# EAGLE design ATOM - 3x Attenuverter Rev6 (EAGLE 9.6.2)
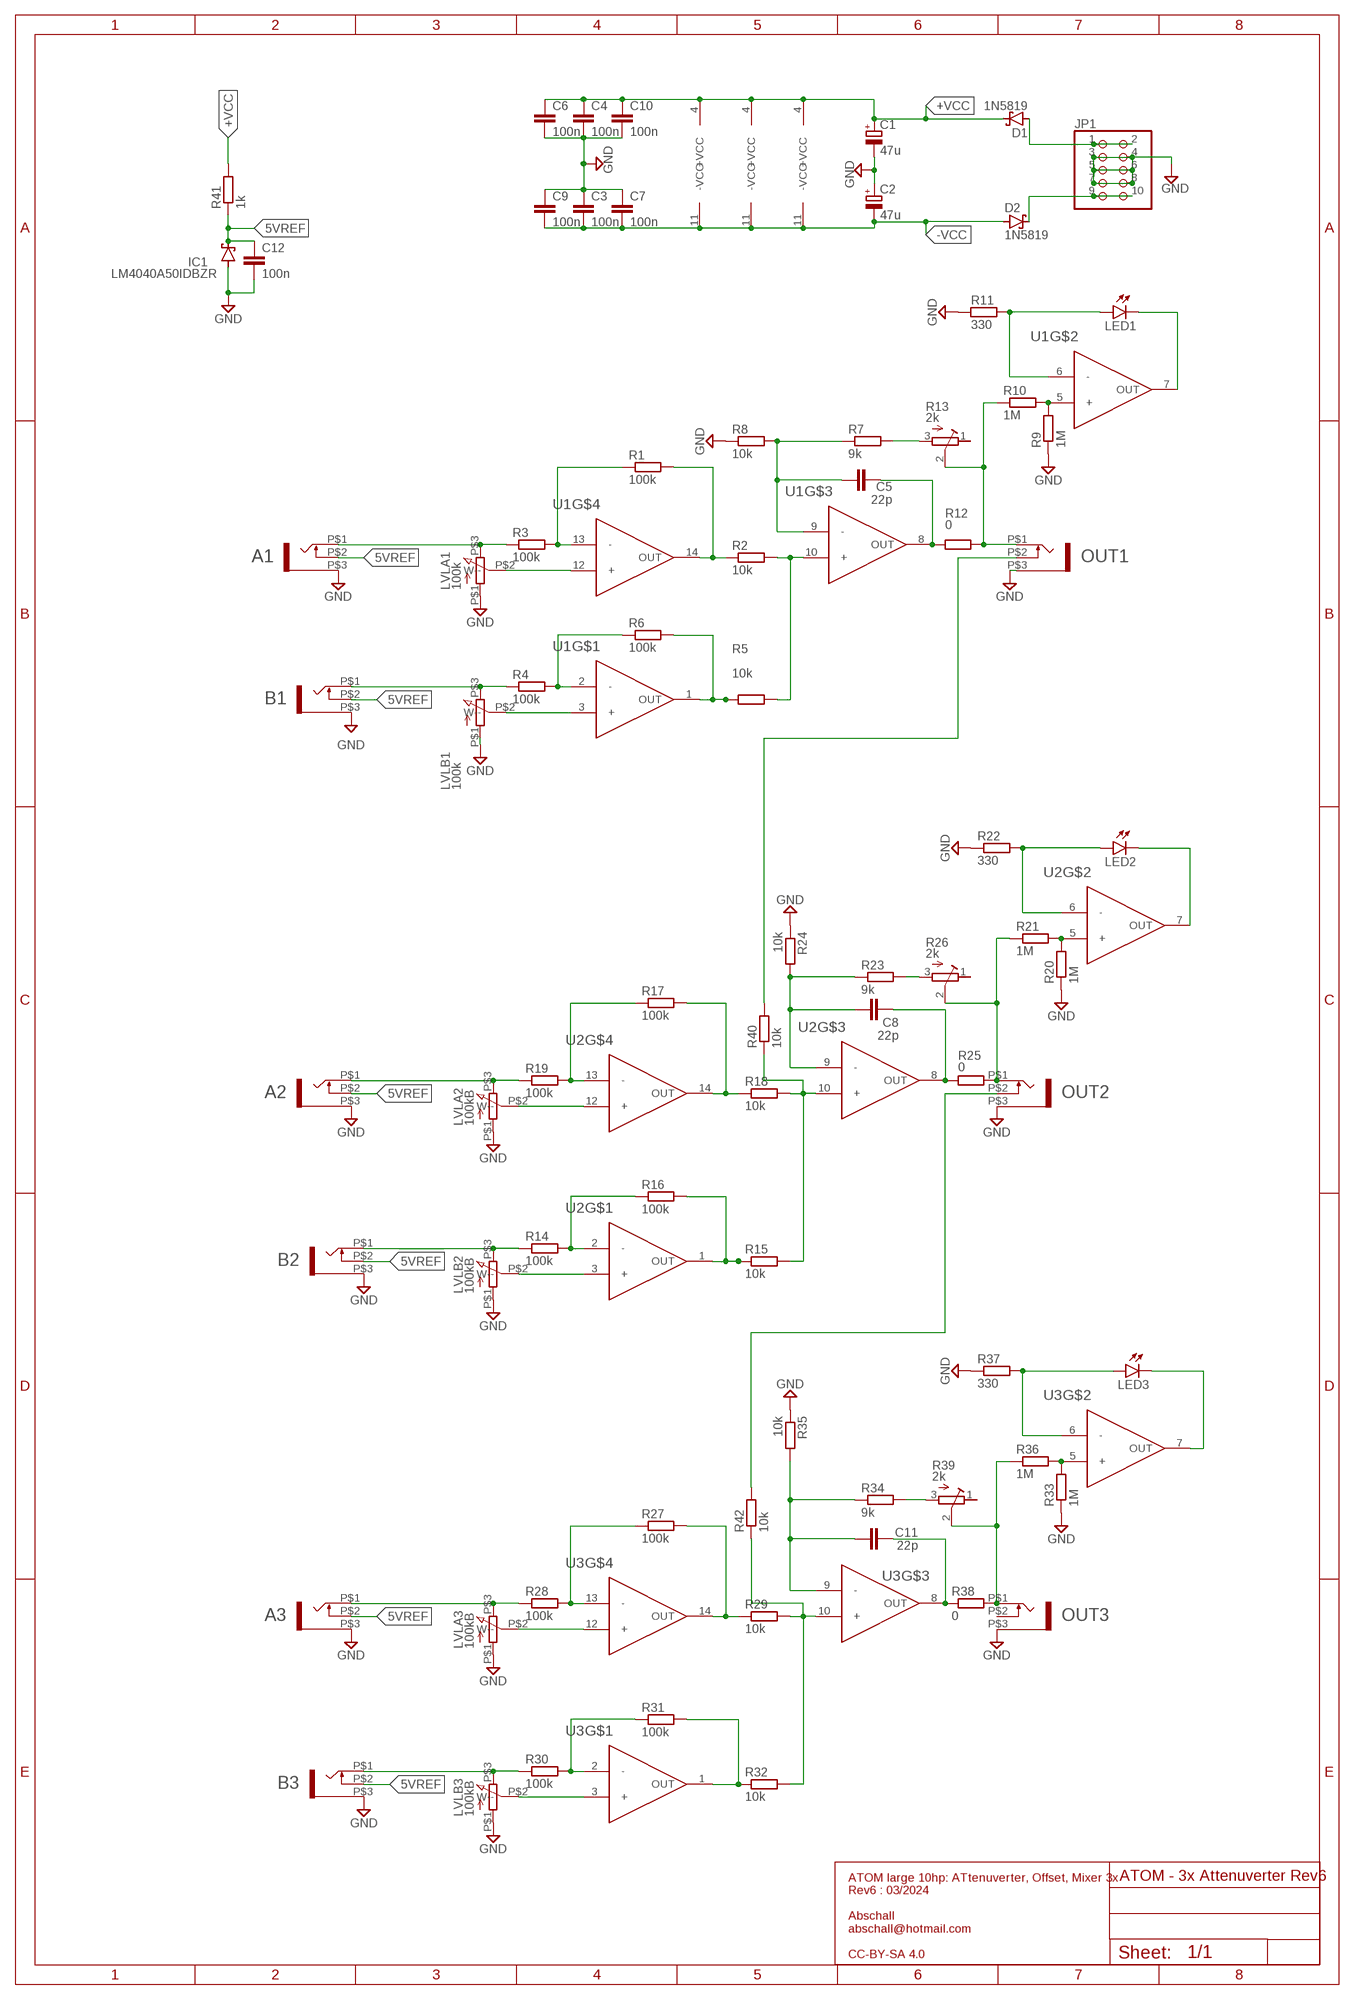
[diagram p0: schematic, sheet 1]

## Parts
A1  WQP-PJ301M-12_JACK  [WQP-PJ301M-12_JACK]
A2  WQP-PJ301M-12_JACK  [WQP-PJ301M-12_JACK]
A3  WQP-PJ301M-12_JACK  [WQP-PJ301M-12_JACK]
B1  WQP-PJ301M-12_JACK  [WQP-PJ301M-12_JACK]
B2  WQP-PJ301M-12_JACK  [WQP-PJ301M-12_JACK]
B3  WQP-PJ301M-12_JACK  [WQP-PJ301M-12_JACK]
C1  47u  CPOL-EUB  [PANASONIC_B]
C2  47u  CPOL-EUB  [PANASONIC_B]
C3  100n  C-EUC0805  [C0805]
C4  100n  C-EUC0805  [C0805]
C5  22p  C-EUC0805  [C0805]
C6  100n  C-EUC0805  [C0805]
C7  100n  C-EUC0805  [C0805]
C8  22p  C-EUC0805  [C0805]
C9  100n  C-EUC0805  [C0805]
C10  100n  C-EUC0805  [C0805]
C11  22p  C-EUC0805  [C0805]
C12  100n  C-EUC0805  [C0805]
D1  1N5819  [SOD123]
D2  1N5819  [SOD123]
IC1  LM4040A50IDBZR  LM4040  [SOT23]
JP1  PINHD-2X5  [2X05]
LED1  LED3MM  [LED3MM]
LED2  LED3MM  [LED3MM]
LED3  LED3MM  [LED3MM]
LVLA1  100k  ALPHA9MM  [ALPHA9MM]
LVLA2  100kB  ALPHA9MM  [ALPHA9MM]
LVLA3  100kB  ALPHA9MM  [ALPHA9MM]
LVLB1  100k  ALPHA9MM  [ALPHA9MM]
LVLB2  100kB  ALPHA9MM  [ALPHA9MM]
LVLB3  100kB  ALPHA9MM  [ALPHA9MM]
OUT1  WQP-PJ301M-12_JACK  [WQP-PJ301M-12_JACK]
OUT2  WQP-PJ301M-12_JACK  [WQP-PJ301M-12_JACK]
OUT3  WQP-PJ301M-12_JACK  [WQP-PJ301M-12_JACK]
R1  100k  R-EU_R0805  [R0805]
R2  10k  R-EU_R0805  [R0805]
R3  100k  R-EU_R0805  [R0805]
R4  100k  R-EU_R0805  [R0805]
R5  10k  R-EU_R0805  [R0805]
R6  100k  R-EU_R0805  [R0805]
R7  9k  R-EU_R0805  [R0805]
R8  10k  R-EU_R0805  [R0805]
R9  1M  R-EU_R0805  [R0805]
R10  1M  R-EU_R0805  [R0805]
R11  330  R-EU_R0805  [R0805]
R12  0  R-EU_R0805  [R0805]
R13  2k  R-TRIMM3314J  [RTRIM3314J]
R14  100k  R-EU_R0805  [R0805]
R15  10k  R-EU_R0805  [R0805]
R16  100k  R-EU_R0805  [R0805]
R17  100k  R-EU_R0805  [R0805]
R18  10k  R-EU_R0805  [R0805]
R19  100k  R-EU_R0805  [R0805]
R20  1M  R-EU_R0805  [R0805]
R21  1M  R-EU_R0805  [R0805]
R22  330  R-EU_R0805  [R0805]
R23  9k  R-EU_R0805  [R0805]
R24  10k  R-EU_R0805  [R0805]
R25  0  R-EU_R0805  [R0805]
R26  2k  R-TRIMM3314J  [RTRIM3314J]
R27  100k  R-EU_R0805  [R0805]
R28  100k  R-EU_R0805  [R0805]
R29  10k  R-EU_R0805  [R0805]
R30  100k  R-EU_R0805  [R0805]
R31  100k  R-EU_R0805  [R0805]
R32  10k  R-EU_R0805  [R0805]
R33  1M  R-EU_R0805  [R0805]
R34  9k  R-EU_R0805  [R0805]
R35  10k  R-EU_R0805  [R0805]
R36  1M  R-EU_R0805  [R0805]
R37  330  R-EU_R0805  [R0805]
R38  0  R-EU_R0805  [R0805]
R39  2k  R-TRIMM3314J  [RTRIM3314J]
R40  10k  R-EU_R0805  [R0805]
R41  1k  R-EU_R0805  [R0805]
R42  10k  R-EU_R0805  [R0805]
U1  TL74H  [SO14]
U2  TL74H  [SO14]
U3  TL74H  [SO14]

## Nets
5VREF: A1.P$2 A2.P$2 A3.P$2 B1.P$2 B2.P$2 B3.P$2 C12.1 IC1.1(C) R41.1
+VCC: C1.+ C4.1 C6.1 C10.1 D1.C R41.2 U1.4(+VCC) U2.4(+VCC) U3.4(+VCC)
-VCC: C2.- C3.2 C7.2 C9.2 D2.A U1.11(-VCC) U2.11(-VCC) U3.11(-VCC)
GND: A1.P$3 A2.P$3 A3.P$3 B1.P$3 B2.P$3 B3.P$3 C1.- C2.+ C3.1 C4.2 C6.2 C7.1 C9.1 C10.2 C12.2 IC1.2(A) JP1.3 JP1.4 JP1.5 JP1.6 JP1.7 JP1.8 LVLA1.P$1 LVLA2.P$1 LVLA3.P$1 LVLB1.P$1 LVLB2.P$1 LVLB3.P$1 OUT1.P$3 OUT2.P$3 OUT3.P$3 R8.1 R9.1 R11.1 R20.1 R22.1 R24.1 R33.1 R35.1 R37.1
N$1: A1.P$1 LVLA1.P$3 R3.1
N$2: R1.1 R3.2 U1.13(-)
N$3: LVLB1.P$2(W--) U1.3(+)
N$4: R1.2 R2.1 U1.14(OUT)
N$5: R2.2 R5.2 U1.10(+)
N$6: R5.1 R6.2 U1.1(OUT)
N$7: R4.2 R6.1 U1.2(-)
N$8: B1.P$1 LVLB1.P$3 R4.1
N$10: C5.1 R7.1 R8.2 U1.9(-)
N$11: OUT1.P$1 R10.1 R12.2 R13.2(S)
N$12: LED1.A R11.2 U1.6(-)
N$13: LED1.K(C) U1.7(OUT)
N$14: R9.2 R10.2 U1.5(+)
N$15: A2.P$1 LVLA2.P$3 R19.1
N$16: LVLA1.P$2(W--) U1.12(+)
N$17: R17.1 R19.2 U2.13(-)
N$18: R17.2 R18.1 U2.14(OUT)
N$19: R15.2 R18.2 R40.1 U2.10(+)
N$20: R14.2 R16.1 U2.2(-)
N$21: C8.1 R23.1 R24.2 U2.9(-)
N$22: B2.P$1 LVLB2.P$3 R14.1
N$23: OUT2.P$1 R21.1 R25.2 R26.2(S)
N$24: LED2.A R22.2 U2.6(-)
N$25: LED2.K(C) U2.7(OUT)
N$26: R20.2 R21.2 U2.5(+)
N$27: R15.1 R16.2 U2.1(OUT)
N$28: LVLA2.P$2(W--) U2.12(+)
N$29: A3.P$1 LVLA3.P$3 R28.1
N$30: LVLB2.P$2(W--) U2.3(+)
N$31: R27.1 R28.2 U3.13(-)
N$32: R27.2 R29.1 U3.14(OUT)
N$33: R29.2 R32.2 R42.1 U3.10(+)
N$34: R30.2 R31.1 U3.2(-)
N$35: C11.1 R34.1 R35.2 U3.9(-)
N$36: B3.P$1 LVLB3.P$3 R30.1
N$37: R23.2 R26.3(A)
N$38: LED3.A R37.2 U3.6(-)
N$39: LED3.K(C) U3.7(OUT)
N$40: R33.2 R36.2 U3.5(+)
N$41: R31.2 R32.1 U3.1(OUT)
N$42: LVLA3.P$2(W--) U3.12(+)
N$43: D2.C JP1.9 JP1.10
N$44: D1.A JP1.1 JP1.2
N$45: LVLB3.P$2(W--) U3.3(+)
N$46: C5.2 R12.1 U1.8(OUT)
N$47: C8.2 R25.1 U2.8(OUT)
N$48: C11.2 R38.1 U3.8(OUT)
N$49: OUT2.P$2 R42.2
N$50: OUT1.P$2 R40.2
N$51: OUT3.P$1 R36.1 R38.2 R39.2(S)
N$52: R7.2 R13.3(A)
N$53: R34.2 R39.3(A)
Unconnected: OUT3.P$2 R13.1(E) R26.1(E) R39.1(E)

## Notes on the sheet
- ATOM large 10hp: ATtenuverter, Offset, Mixer 3x
  Rev6 : 03/2024
  
  Abschall
  abschall@hotmail.com
  
  CC-BY-SA 4.0

## Library data of the parts
A1-A3 B1-B3 OUT1-OUT3 = thonkiconn:WQP-PJ301M-12_JACK
C1 C2 = rcl:CPOL-EU: POLARIZED CAPACITOR, European symbol; SPICEPREFIX: C
C3-C12 = resistor:C-EU: CAPACITOR, European symbol
D1 D2 = personal-ICs:1N5819
IC1 = personal-ICs:LM4040
JP1 = pinhead:PINHD-2X5: PIN HEADER
LED1-LED3 = led:LED: LED OSRAM: - CHIPLED LG R971, LG N971, LY N971, LG Q971, LY Q971, LO R971, LY R971 LH N974, LH R974 LS Q976, LO Q976, LY Q976 LO Q996 - Hyper CHIPLED LW Q18S LB Q993, LB Q99A, LB R99A - SideLED LS A670, LO A670, LY A670, LG A670, LP A670 LB A673, LV A673, LT A673, LW A673 LH A674 LY A675 LS A676, LA A676, LO A676, LY A676, LW A676 LS A679, LY A679, LG A679 - Hyper Micro SIDELED® LS Y876, LA Y876, LO Y876, LY Y876 LT Y87S - SmartLED LW L88C, LW L88S LB L89C, LB L89S, LG L890 LS L89K, LO L89K, LY L89K LS L896, LA L896, LO L896, LY L896 - TOPLED LS T670, LO T670, LY T670, LG T670, LP T670 LSG T670, LSP T670, LSY T670, LOP T670, LYG T670 LG T671, LOG T671, LSG T671 LB T673, LV T673, LT T673, LW T673 LH T674 LS T676, LA T676, LO T676, LY T676, LB T676, LH T676, LSB T676, LW T676 LB T67C, LV T67C, LT T67C, LS T67K, LO T67K, LY T67K, LW E67C LS E67B, LA E67B, LO E67B, LY E67B, LB E67C, LV E67C, LT E67C LW T67C LS T679, LY T679, LG T679 LS T770, LO T770, LY T770, LG T770, LP T770 LB T773, LV T773, LT T773, LW T773 LH T774 LS E675, LA E675, LY E675, LS T675 LS T776, LA T776, LO T776, LY T776, LB T776 LHGB T686 LT T68C, LB T68C - Hyper Mini TOPLED® LB M676 - Mini TOPLED Santana® LG M470 LS M47K, LO M47K, LY M47K Source: http://www.osram.convergy.de LUXEON: - LUMILED® LXK2-PW12-R00, LXK2-PW12-S00, LXK2-PW14-U00, LXK2-PW14-V00 LXK2-PM12-R00, LXK2-PM12-S00, LXK2-PM14-U00 LXK2-PE12-Q00, LXK2-PE12-R00, LXK2-PE12-S00, LXK2-PE14-T00, LXK2-PE14-U00 LXK2-PB12-K00, LXK2-PB12-L00, LXK2-PB12-M00, LXK2-PB14-N00, LXK2-PB14-P00, LXK2-PB14-Q00 LXK2-PR12-L00, LXK2-PR12-M00, LXK2-PR14-Q00, LXK2-PR14-R00 LXK2-PD12-Q00, LXK2-PD12-R00, LXK2-PD12-S00 LXK2-PH12-R00, LXK2-PH12-S00 LXK2-PL12-P00, LXK2-PL12-Q00, LXK2-PL12-R00 Source: www.luxeon.com KINGBRIGHT: KA-3528ASYC Source: www.kingbright.com
LVLA1-LVLA3 LVLB1-LVLB3 = potentiometer:ALPHA9MM
R1-R12 R14-R25 R27-R38 R40-R42 = resistor:R-EU_: RESISTOR, European symbol
R13 R26 R39 = resistor:R-TRIMM: Trimm resistor
U1-U3 = personal devices:TL74H

## Board
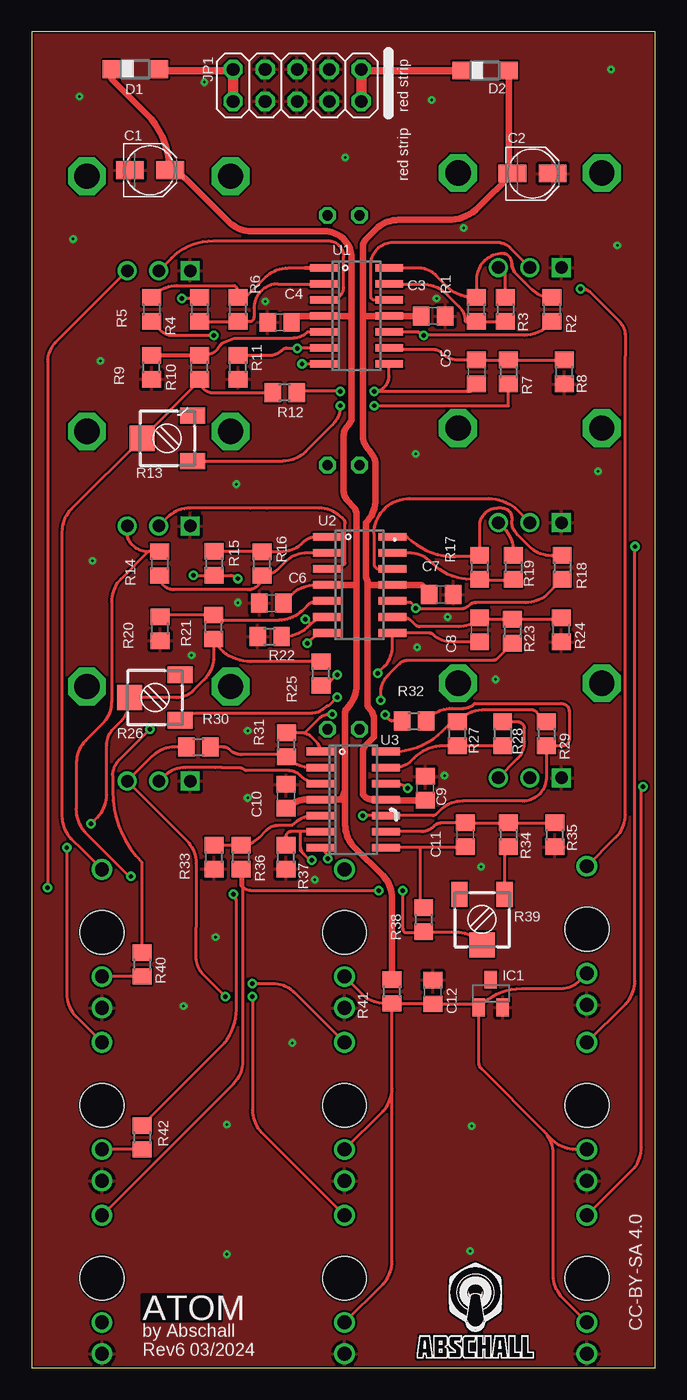
[diagram p1: board, top side]
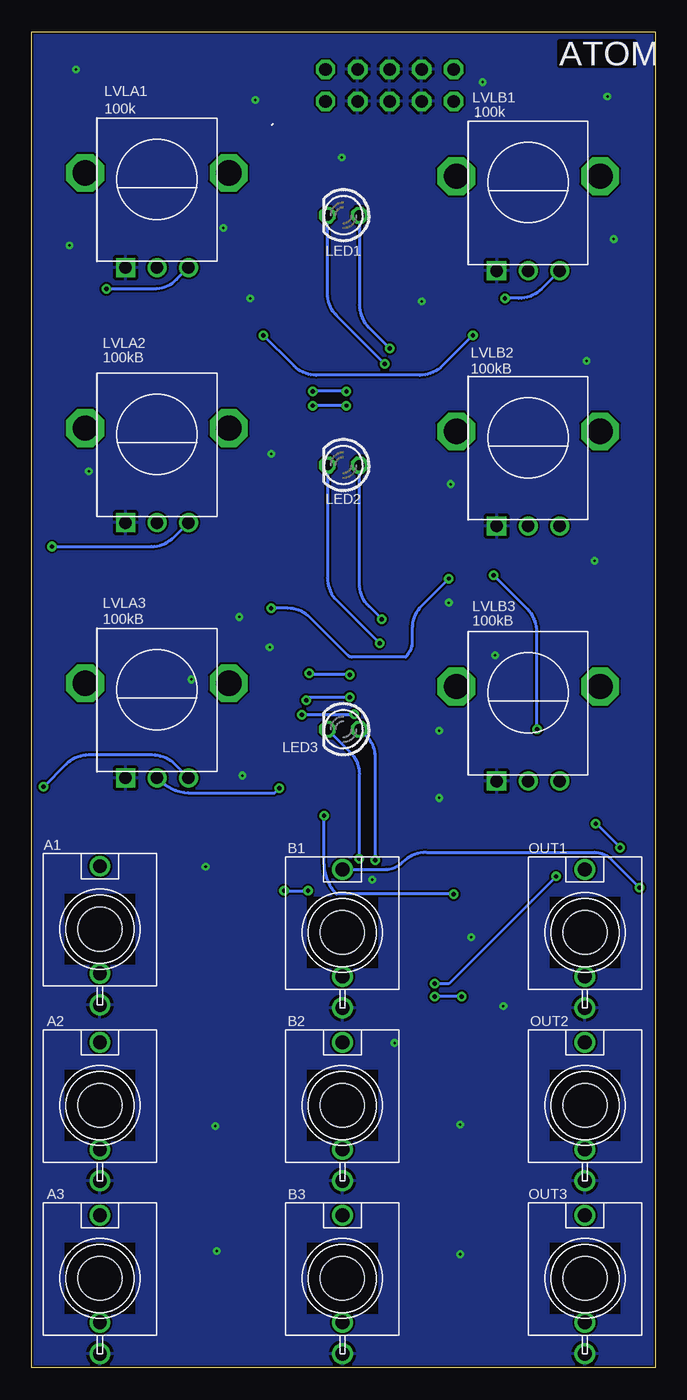
[diagram p2: board, bottom side, seen from below]

Size 49.5 x 106 mm. Coordinates in mm from the lower left corner, seen from the top.
Outline: 0,0 49.5,0 49.5,106 0,106 0,0
Copper layers (1*16): Top 0.035mm / dielectric 1.5mm / Bottom 0.035mm
Design rules "default *": minimum track width 6mil, minimum drill 0.35mm, track to track 6mil, track to pad 6mil, pad to pad 6mil, via to via 6mil, smd to smd 6mil, copper to edge 6mil, drill to drill 6mil, minimum pad ring 10mil, minimum via ring 8mil, stop-mask expansion 4mil, vias tented up to drill 0mil, thermal gap 10mil

### Footprints (pad centres in the part's own frame; a part is rotated, then mirrored left to right if it is on the bottom)
WQP-PJ301M-12_JACK = drill 1.1: P$1 0,5; P$2 0,-3.5; P$3 0,-5.992 | hole 3.5: 0,0
PANASONIC_B = smd 2.2 x 1.4: + 1.6,0; - -1.6,0
C0805 = smd 1.3 x 1.5: 1 -0.95,0; 2 0.95,0
SOD123 = smd 1.4 x 1.4: A 1.9,0; C -1.9,0
SOT23 = smd 1 x 1.4: 1 -0.95,-1.1; 2 0.95,-1.1; 3 0,1.1
2X05 = drill 1.016 octagon: 1 -5.08,-1.27; 2 -5.08,1.27; 3 -2.54,-1.27; 4 -2.54,1.27; 5 0,-1.27; 6 0,1.27; 7 2.54,-1.27; 8 2.54,1.27; 9 5.08,-1.27; 10 5.08,1.27
LED3MM = drill 0.813 octagon: A -1.27,0; K 1.27,0
ALPHA9MM = drill 2 octagon: GND -5.715,0.515; GND2 5.685,0.515 | drill 1 square: P$1 -2.515,-6.985 | drill 1: P$2 -0.015,-6.985; P$3 2.485,-6.985
R0805 = smd 1.3 x 1.5: 1 -0.95,0; 2 0.95,0
RTRIM3314J = smd 1.3 x 2: 1 1.8,-2; 3 -1.8,-2 | smd 2 x 2: 2 0,2
SO14 = smd 0.6 x 2.2: 1 -3.81,-2.6; 2 -2.54,-2.6; 3 -1.27,-2.6; 4 0,-2.6; 5 1.27,-2.6; 6 2.54,-2.6; 7 3.81,-2.6; 8 3.81,2.6; 9 2.54,2.6; 10 1.27,2.6; 11 0,2.6; 12 -1.27,2.6; 13 -2.54,2.6; 14 -3.81,2.6

### Placement (x,y rotation side)
A1  44.07,34.8 0 bottom
A2  44.07,20.83 0 bottom
A3  44.07,7.11 0 bottom
B1  24.83,34.54 0 bottom
B2  24.83,20.83 0 bottom
B3  24.83,7.11 0 bottom
C1  9.4,95 0 top
C2  39.75,94.74 0 top
C3  31.88,83.44 180 top
C4  19.68,82.93 180 top
C5  35.31,78.99 270 top
C6  19.03,60.66 180 top
C7  32.51,61.34 180 top
C8  35.56,58.55 270 top
C9  31.24,45.97 270 top
C10  20.19,45.34 90 top
C11  34.42,42.29 270 top
C12  31.84,29.83 90 top
D1  8.25,103.01 0 top
D2  35.98,102.91 0 top
IC1  36.44,29.7 0 top
JP1  21.08,101.73 0 top
LED1  24.75,91.42 180 bottom
LED2  24.75,71.61 180 bottom
LED3  24.75,50.66 180 bottom
LVLA1  39.53,94.27 0 bottom
LVLA2  39.53,74.03 0 bottom
LVLA3  39.53,53.79 0 bottom
LVLB1  10.08,94.01 0 bottom
LVLB2  10.08,73.77 0 bottom
LVLB3  10.08,53.54 0 bottom
OUT1  5.59,34.54 0 bottom
OUT2  5.59,20.83 0 bottom
OUT3  5.59,7.11 0 bottom
R1  35.31,83.95 90 top
R2  41.27,83.95 270 top
R3  37.59,83.95 270 top
R4  13.34,83.95 270 top
R5  9.53,83.95 270 top
R6  16.38,83.95 90 top
R7  37.85,78.99 270 top
R8  42.29,78.99 90 top
R9  9.53,79.38 90 top
R10  13.34,79.38 90 top
R11  16.38,79.38 90 top
R12  20.08,77.36 180 top
R13  10.78,73.73 90 top
R14  10.16,63.8 270 top
R15  14.48,63.81 270 top
R16  18.29,63.8 90 top
R17  35.56,63.5 90 top
R18  42.1,63.5 270 top
R19  38.23,63.5 270 top
R20  10.2,58.64 90 top
R21  14.45,58.77 90 top
R22  18.89,58 0 top
R23  38.16,58.42 270 top
R24  42.04,58.55 90 top
R25  22.96,55.08 90 top
R26  9.79,53.17 90 top
R27  33.78,50.29 90 top
R28  37.38,50.29 270 top
R29  40.85,50.29 270 top
R30  13.23,49.25 0 top
R31  20.22,49.43 90 top
R32  30.35,51.31 0 top
R33  14.48,40.51 90 top
R34  37.85,42.29 270 top
R35  41.53,42.29 90 top
R36  16.64,40.51 90 top
R37  20.19,40.51 90 top
R38  31.11,35.56 270 top
R39  35.75,35.56 180 top
R40  8.76,32 270 top
R41  28.61,29.86 90 top
R42  8.76,18.29 270 top
U1  25.78,83.44 270 top
U2  26.04,62.1 270 top
U3  25.53,45.09 270 top

### Tracks (layer width: path | path; a pad name or v marks a point on that pad's centre or on a via)
5VREF
  Top 0.254: R41.1 arc45 28.7,28.88 C12.1 34.83,28.88 arc-45 IC1.1 | IC1.1 35.64,28.76 arc-45 38.88,30.1 42.04,30.1 arc45 43.46,30.69 A1.P$2 | R41.1 28.01,28.91 arc-45 26.22,29.66 B1.P$2 | A2.P$2 43.16,17.33 arc-45 41.36,18.07 40.66,18.78 | IC1.1 35.49,24.28 arc45 35.72,23.71 40.66,18.78 | B2.P$2 27.87,20.37 arc45 28.61,22.16 | 28.61,22.16 R41.1 | B3.P$2 27.87,6.65 arc45 28.61,8.45 28.61,22.16 | A3.P$2 42.15,5.54 arc-45 41.4,7.33 41.4,16.98 arc45 40.66,18.78
+VCC
  Top 0.254: C6.1 20.68,61.36 arc-45 22.48,62.1 U2.4
  Top 0.508: D1.C 6.35,102.3 arc-45 6.4,102.19 9.11,99.47 arc-45 10.94,95.05 C1.+ 11.35,94.65 arc-45 12.3,94.25 15.64,90.91 arc45 17.43,90.17 23.24,90.17 arc-90 25.4,88.01 25.4,83.44 | 25.78,62.1 25.78,67.69 arc45 25.51,68.34 25.15,68.71 arc-45 24.77,69.63 24.77,73.88 arc-45 25.15,74.8 arc45 25.4,75.42 25.4,83.44 | 25.78,62.1 25.78,54.16 arc-45 25.02,52.32 arc45 24.89,52.02 24.89,46.01 | 24.89,46.01 arc-45 24.51,45.09 U3.4 21.87,45.09 arc45 C10.1 | R41.2 28.61,37.27 arc45 27.87,39.06 25.64,41.29 arc-45 24.89,43.09 24.89,46.01 | C4.1 arc-90 20.76,82.93 21.27,83.44 U1.4 25.4,83.44 | U2.4 25.78,62.1
-VCC
  Top 0.508: C3.2 arc45 30.78,83.44 U1.11 26.29,83.44 | 26.67,62.41 26.54,62.72 26.54,67.05 arc45 27.3,68.89 27.3,71.55 arc45 26.8,72.77 arc-45 26.29,74 26.29,83.44 | 26.67,62.41 arc45 26.8,62.1 U2.11 30.92,62.1 arc-45 C7.2 | 26.67,62.41 26.67,52.63 arc45 26.8,52.32 arc-45 27.18,51.4 27.18,50.04 26.47,49.33 arc45 26.29,48.9 26.29,45.65 arc45 26.42,45.34 arc45 27.03,45.09 U3.11 arc45 28.27,45.02 C9.2 | D2.A 37.88,95.01 C2.- 35.47,92.06 arc-45 33.06,91.06 29.12,91.06 arc45 27.32,90.31 26.54,89.53 arc45 26.29,88.92 26.29,83.44
GND  (via drill 0.2)
  other vias: 3.81,100.84 13.72,101.98 31.75,100.58 24.89,96.01 3.3,89.53 34.29,90.42 32.13,84.84 30.48,72.52 16.26,70.1 16.38,60.71 12.7,56.52 36.83,54.61 33.02,59.56 15.49,9.02 35.69,39.75 18.54,84.58 32.77,46.99 17.14,45.21 14.61,34.16 22.48,38.73 45.97,103 46.48,89.03 5.46,79.88 4.83,64.01 15.49,19.3 34.92,19.18 34.8,9.27 44.96,71.12 30.61,57.15 12.06,28.7 20.7,25.78 17.14,50.55
  pour Top: -1.4,105.92 -1.4,0 56.01,0 56.01,105.92
  pour Bottom: -0.38,106.43 -0.38,0 62.36,0 62.36,106.43
N$1  (via drill 0.35)
  Top 0.254: R3.1 37.59,86.87 37.27,87.19 arc45 LVLA1.P$3 | A1.P$1 46.37,42.1 arc45 47.12,43.9 47.12,80.26 47.12,81.83 arc45 46.61,83.06 44.43,85.24 arc45 v43.56,85.6
  Bottom 0.254: v43.56,85.6 39.78,85.6 arc-45 37.98,86.34 LVLA1.P$3
N$2
  Top 0.254: U1.13 30.95,85.98 arc-45 32.97,85.14 33.93,84.18 arc-45 34.41,83.03 arc45 34.49,83 R1.1 R3.2
N$3
  Top 0.254: U1.3 23.75,84.71 arc90 24.77,85.72 24.77,88.14 arc90 23.5,89.41 14.43,89.41 arc45 11.1,88.03 LVLB1.P$2
N$4
  Top 0.254: U1.14 30.6,87.25 arc-45 32.13,86.61 32.98,85.77 arc45 35.08,84.9 R1.2 35.31,86.32 arc-90 37.37,88.39 arc-90 38.1,87.67 38.1,87.63 | 38.46,86.76 arc-45 38.1,87.63 | 38.1,87.63 arc45 38.46,86.76 | R2.1 arc-45 39.65,85.57 38.46,86.76
N$5  (via drill 0.35)
  Top 0.254: R2.2 40.94,82.66 arc-45 39.14,81.92 v31.11,81.92 arc45 30.5,82.17 U1.10 | R5.2 10.21,82.32 arc45 11.18,81.92 v14.48,81.92
  Bottom 0.254: v14.48,81.92 16.91,79.48 arc45 18.7,78.74 26.89,78.74 arc45 28.68,79.48 v31.11,81.92
N$6
  Top 0.254: 21.72,87.25 20.36,87.25 arc45 18.56,86.5 17.35,85.3 arc-45 R6.2 16.38,85.24 arc45 16.13,85.85 11.53,85.85 arc45 9.74,85.11 R5.1
  Top 0.305: U1.1 21.72,87.25
N$7
  Top 0.254: U1.2 19.56,85.98 arc90 17.65,84.07 17.65,83.36 arc-45 17.53,83.06 arc-45 17.38,83 R6.1 R4.2
N$8  (via drill 0.35)
  Top 0.254: v11.94,84.84 13.19,84.84 arc45 R4.1 | LVLB1.P$3 1.89,81.32 arc45 1.27,79.83 v1.27,38.1
  Bottom 0.254: LVLB1.P$3 9.04,85.58 arc45 10.84,84.84 v11.94,84.84 | v1.27,38.1 3.52,40.35 arc-45 4.83,40.89 18.18,40.89 arc-45 20.07,40.11 20.12,40.06 arc45 21.37,39.54 B1.P$1
N$10
  Top 0.254: U1.9 28.12,80.9 arc45 27.81,80.77 31.9,80.77 arc-45 32.51,80.52 arc45 33.9,79.94 C5.1 R7.1 R8.2
N$11
  Top 0.254: R12.2 14.4,77.36 arc-90 R10.1 arc90 13.22,78.31 13.22,78.18 R13.2 3.16,68.11 arc45 2.41,66.32 2.41,52.83 2.41,43.77 arc45 3.16,41.98 4.02,41.11 OUT1.P$1
N$12  (via drill 0.35)
  Top 0.254: R11.2 18.86,80.33 arc45 19.94,80.77 arc-45 20.25,80.9 21.14,80.9 arc45 v21.08,80.88 21.11,80.9 U1.6
  Bottom 0.254: v21.08,80.88 22.74,82.53 arc45 23.48,84.33 LED1.A
N$13  (via drill 0.35)
  Top 0.254: U1.7 v21.46,79.63
  Bottom 0.254: v21.46,79.63 25.28,83.44 arc45 26.02,85.24 LED1.K
N$14
  Top 0.254: U1.5 21.88,82.17 arc-45 20.66,81.66 16.09,81.66 15.29,81.33 arc45 14.73,80.77 arc-45 13.65,80.33 R10.2 13.21,80.33
  Top 0.305: R9.2 13.21,80.33
N$15  (via drill 0.35)
  Top 0.254: LVLA2.P$3 37.48,66.6 arc-45 38.23,64.81 R19.1 | A2.P$1 47.13,28.89 arc45 47.88,30.69 v47.88,65.15
  Bottom 0.254: v47.88,65.15 39.99,65.15 arc-45 38.19,65.89 LVLA2.P$3
N$16
  Top 0.254: U1.12 27.18,84.71 arc-90 26.92,84.96 26.92,87.5 arc-90 28.7,89.28 36.95,89.28 arc-45 37.97,88.86 LVLA1.P$2
N$17
  Top 0.254: U2.13 29.94,64.64 arc-45 31.73,63.9 31.83,63.8 arc45 34.85,62.55 R17.1 35.56,62.48 38.16,62.48 arc90 R19.2
N$18
  Top 0.254: U2.14 29.81,65.91 arc45 33.6,64.34 35.45,64.34 R17.2 35.56,66.8 arc-90 36.96,68.2 37.34,68.2 arc-90 38.1,67.44 38.1,67.18 arc45 38.55,66.1 38.86,65.79 39.12,65.53 39.45,65.19 arc45 41.25,64.45 R18.1
N$19  (via drill 0.35)
  Top 0.254: R18.2 41,61.45 arc-45 39.2,60.71 35.28,60.71 arc45 34.67,60.45 arc-45 34.06,60.2 30.73,60.2 arc-45 30.52,60.29 | 30.52,60.29 30.1,60.71 28.94,60.71 arc-45 U2.10 | R15.2 14.73,62.86 | 14.73,62.86 15.78,62.86 arc-45 v16.38,62.61 | v30.49,60.26 30.52,60.29 | R40.1 8.76,40.11 arc-45 6.44,45.72 6.44,46.99 arc-45 6.95,48.23 v9.4,50.67 | v12.83,62.87 14.72,62.87 arc-45 14.73,62.86
  Bottom 0.254: v16.38,62.61 18.56,60.43 arc-45 19.3,58.64 19.3,57.61 arc45 19.81,56.39 24.08,56.39 arc45 24.38,56.52 27.39,59.52 arc-45 29.18,60.26 v30.49,60.26 | v9.4,50.67 9.4,58.38 arc-45 10.14,60.18 v12.83,62.87
N$20
  Top 0.254: R14.2 arc90 11.29,61.72 17.16,61.72 arc90 R16.1 arc45 19.56,63.38 20.08,63.9 arc-45 21.88,64.64 U2.2
N$21
  Top 0.254: R24.2 41.91,59.37 R23.1 35.69,59.37 C8.1 arc-45 33.88,58.8 30.79,58.8 arc-45 30.48,58.93 30.23,59.18 arc45 29.31,59.56 U2.9
N$22  (via drill 0.35)
  Top 0.254: B2.P$1 20.92,29.74 arc45 19.13,30.48 v17.53,30.48 | 9.27,64.75 arc-45 8,65.28 arc-45 7.59,66.26 LVLB2.P$3 | R14.1 9.27,64.75 | 9.27,64.75 7.09,62.58 arc45 6.35,60.78 6.35,52.87 arc-45 5.61,51.07 4.3,49.77 arc45 3.56,47.97 3.56,44.36 arc45 4.39,42.35 7.75,38.99 v7.87,38.99
  Bottom 0.254: v7.87,38.99 16.38,30.48 v17.53,30.48
N$23  (via drill 0.35)
  Top 0.254: R25.2 17.4,56.03 arc-45 14.99,57.03 14.54,57.47 14.54,57.73 R21.1 14.45,56.4 arc-45 13.71,54.6 12.83,53.72 arc-45 11.49,53.17 R26.2 7.79,52.95 arc-45 7.11,51.31 6.51,50.7 arc45 5.97,49.4 5.97,45.48 arc-45 5.22,43.68 v4.73,43.18 | v2.79,41.27 2.79,29.68 arc45 3.54,27.88 OUT2.P$1
  Bottom 0.254: v2.79,41.27 4.7,43.18 arc-45 v4.73,43.18
N$24  (via drill 0.35)
  Top 0.254: U2.6 arc45 22.24,59.07 22.11,58.95 | R22.2 arc45 22.11,58.95 | 22.11,58.95 arc45 22.08,59.03 v21.71,59.4
  Bottom 0.254: v21.71,59.4 22.74,60.42 arc45 23.48,62.22 LED2.A
N$25  (via drill 0.35)
  Top 0.254: v21.89,57.49 22.17,57.77 arc-45 U2.7
  Bottom 0.254: v21.89,57.49 25.28,60.88 arc45 26.02,62.67 LED2.K
N$26
  Top 0.254: R20.2 10.32,59.72 R21.2 arc45 15.44,59.31 19.65,59.31 arc45 21.45,60.05 21.84,60.45 arc-45 22.76,60.83 U2.5
N$27
  Top 0.254: U2.1 22.51,65.91 arc45 21.59,65.53 21.55,65.49 arc-45 19.75,64.75 R16.2 14.51,64.75 arc-45 R15.1
N$28
  Top 0.254: U2.12 27.56,63.37 arc-90 27.18,63.75 27.18,66.17 arc-90 29.97,68.96 36.26,68.96 arc-45 38.59,67.99 LVLA2.P$2
N$29  (via drill 0.35)
  Top 0.254: LVLA3.P$3 38.56,48.32 arc45 39.12,49.66 39.12,50.75 arc45 38.99,51.05 arc45 38.53,51.24 R28.1 | A3.P$1 47.64,15.68 arc45 48.39,17.48 48.39,45.97 48.5,46.09 arc-45 v48.54,46.1
  Bottom 0.254: v48.54,46.1 46.74,47.9 arc45 44.94,48.64 39.93,48.64 arc45 38.14,47.9 LVLA3.P$3
N$30
  Top 0.254: U2.3 23.79,63.37 arc45 24.89,63.83 24.89,67 arc45 24.77,67.31 24.62,67.45 arc45 22.82,68.2 18.67,68.2 17.35,68.2 12.56,68.2 arc45 10.76,67.45 LVLB2.P$2
N$31
  Top 0.254: R28.2 R27.1 32.67,49.34 arc45 30.35,48.38 30.1,48.13 arc-45 28.87,47.62 U3.13
N$32
  Top 0.254: R29.1 40.06,52.03 arc45 39.66,52.2 35.99,52.2 arc45 33.85,51.31 R27.2 33.66,51.12 arc45 32.89,50.8 32.62,50.52 arc-45 28.68,48.9 U3.14
N$33  (via drill 0.35)
  Top 0.254: v26.29,43.81 U3.10 31.82,43.81 arc45 32.13,43.94 32.4,44.21 arc-45 34.2,44.96 38.95,44.96 arc90 40.85,46.86 R29.2 42.1,49.34 arc90 42.67,49.91 42.67,52.07 arc90 42.04,52.7 35.18,52.7 arc-45 34.26,52.32 33.37,52.32 arc45 31.57,51.58 R32.2 | R42.1 15.06,25.54 arc45 16.26,28.42 16.26,36.98 arc45 v16,37.59
  Bottom 0.254: v16,37.59 25.27,37.59 25.33,37.65 arc45 26.29,39.97 v26.29,43.81
N$34
  Top 0.254: U3.2 22.12,47.62 arc-45 20.33,48.37 R31.1 arc45 19.82,48.64 16.67,48.64 arc-45 15.75,49.02 arc45 15.2,49.25 R30.2
N$35
  Top 0.254: U3.9 30.96,42.55 arc45 31.88,42.93 arc-45 32.64,43.24 C11.1 R34.1 R35.2
N$36  (via drill 0.35)
  Top 0.254: R30.1 11.35,49.25 arc45 9.55,48.5 LVLB3.P$3 12.31,41.83 arc-45 13.06,40.04 13.06,34.92 13.06,32.62 arc45 13.65,31.18 v15.37,29.46 | v17.53,29.46 17.53,20.47 arc45 18.27,18.67 B3.P$1
  Bottom 0.254: v15.37,29.46 v17.53,29.46
N$37  (via drill 0.35)
  Top 0.254: R26.3 arc-45 13.18,51.94 22.14,51.94 arc45 23.37,52.45 arc-45 23.59,52.54 v24.26,53.21 | v24.26,53.21 | v27.71,52.96 27.71,53.51 arc-45 28.33,55 29.21,55.88 arc-45 29.82,56.13 36.67,56.13 arc45 36.94,56.25 R23.2
  Bottom 0.254: v27.71,52.96 27.45,53.21 v24.26,53.21
N$38  (via drill 0.35)
  Top 0.254: U3.6 21.34,42.55 | 21.34,42.55 20.57,42.55 arc90 20.19,42.16 R37.2 | 21.34,41.47 21.34,41.02 21.65,40.7 | 21.65,40.7 22.01,40.35 arc45 v22.23,40.26 | 21.65,40.7 arc-45 21.34,41.47 | 21.34,41.47 21.34,42.55
  Bottom 0.254: v22.23,40.26 22.23,48.52 arc-45 22.84,50.01 LED3.A
N$39  (via drill 0.35)
  Top 0.254: U3.7 23.27,40.93 arc-45 v23.5,40.39
  Bottom 0.254: v23.5,40.39 23.5,47.08 arc-45 24.24,48.87 LED3.K
N$40
  Top 0.254: R33.2 R36.2 arc45 18.04,42.05 18.67,42.67 arc-45 19.59,43.05 20.68,43.05 arc-45 22.52,43.81 U3.5
N$41  (via drill 0.35)
  Top 0.254: U3.1 arc45 22.61,49.65 22.1,50.16 21.83,50.28 21.65,50.35 | 21.65,50.35 arc45 21.59,50.38 R31.2 | R32.1 28.57,51.31 arc-45 v28.07,51.82 | v23.88,51.85 23.7,51.85 arc45 22.75,51.45 21.65,50.35
  Bottom 0.254: v28.07,51.82 23.95,51.82 arc-45 v23.88,51.85
N$42  (via drill 0.35)
  Top 0.254: U3.12 28.93,46.35 arc-45 v29.84,45.97
  Bottom 0.254: LVLA3.P$2 39.46,46.72 arc-45 36.74,45.59 30.23,45.59 v29.84,45.97
N$43
  Top 0.61: D2.C 26.37,102.91 arc-45 JP1.10
  Top 0.813: JP1.9 JP1.10
N$44
  Top 0.61: D1.A 10.28,102.88 15.89,102.88 arc90 JP1.2
  Top 0.813: JP1.2 JP1.1
N$45
  Top 0.254: U3.3 22.87,46.35 arc-45 21.34,46.99 arc45 20.42,47.37 17.02,47.37 arc45 16.41,47.62 15.11,47.62 14.61,47.62 12.22,47.62 arc45 10.43,46.88 LVLB3.P$2
N$46  (via drill 0.35)
  Top 0.254: v24.51,77.47 21.15,77.47 arc90 R12.1 | U1.8 28.38,78.67 arc-90 v27.18,77.47 34.73,77.47 arc90 C5.2
  Bottom 0.254: v24.51,77.47 v27.18,77.47
N$47  (via drill 0.35)
  Top 0.254: C8.2 33.25,57.6 arc-45 31.88,58.17 arc45 31.57,58.29 U2.8 28.64,57.2 arc-45 27.98,55.62 v27.45,55.1 | v24.26,54.99 23.7,54.44 arc-45 R25.1
  Bottom 0.254: v24.26,54.99 27.2,54.99 arc45 v27.45,55.1
N$48
  Top 0.254: C11.2 arc-45 34.26,41.27 30.86,41.27 | 30.86,41.27 U3.8 | R38.1 arc-45 30.86,37.12 30.86,41.27
N$49
  Top 0.254: R42.2 5.61,17.34 arc45 OUT2.P$2
N$50
  Top 0.254: R40.2 5.61,31.05 arc45 OUT1.P$2
N$51  (via drill 0.35)
  Top 0.254: 30.96,34.54 29.59,34.54 arc-45 29.46,34.85 v29.46,37.85 | 30.96,34.54 arc45 R38.2 | R39.2 35.51,33.8 arc45 33.72,34.54 30.96,34.54 | v27.56,37.85 17.56,37.85 arc-45 16.64,38.23 R36.1 arc-45 16.76,39.26 16.76,24.34 arc-45 16.02,22.54 OUT3.P$1
  Bottom 0.254: v29.46,37.85 v27.56,37.85
N$52  (via drill 0.35)
  Top 0.254: R13.3 19.95,71.93 arc45 21.75,72.68 23.88,74.81 arc45 v24.51,76.33 | v27.18,76.33 37.85,76.33 R7.2
  Bottom 0.254: v24.51,76.33 v27.18,76.33
N$53
  Top 0.254: R39.3 37.55,40.62 arc-45 R34.2
(copper drawn outside any net)
  shapes: Top area x17168

### Text on the board
Top: ATOM | D:/Images/Inkspace/Upschall/Abschall Vertical Logo Simple.bmp
Bottom: ATOM
tPlace: red strip | red strip | ATOM | CC-BY-SA 4.0 | by Abschall / Rev6 03/2024 | D:/Images/Inkspace/Upschall/Abschall Vertical Logo Simple.bmp
bPlace: ATOM